# EAGLE design source_eagle (EAGLE 9.6.2)
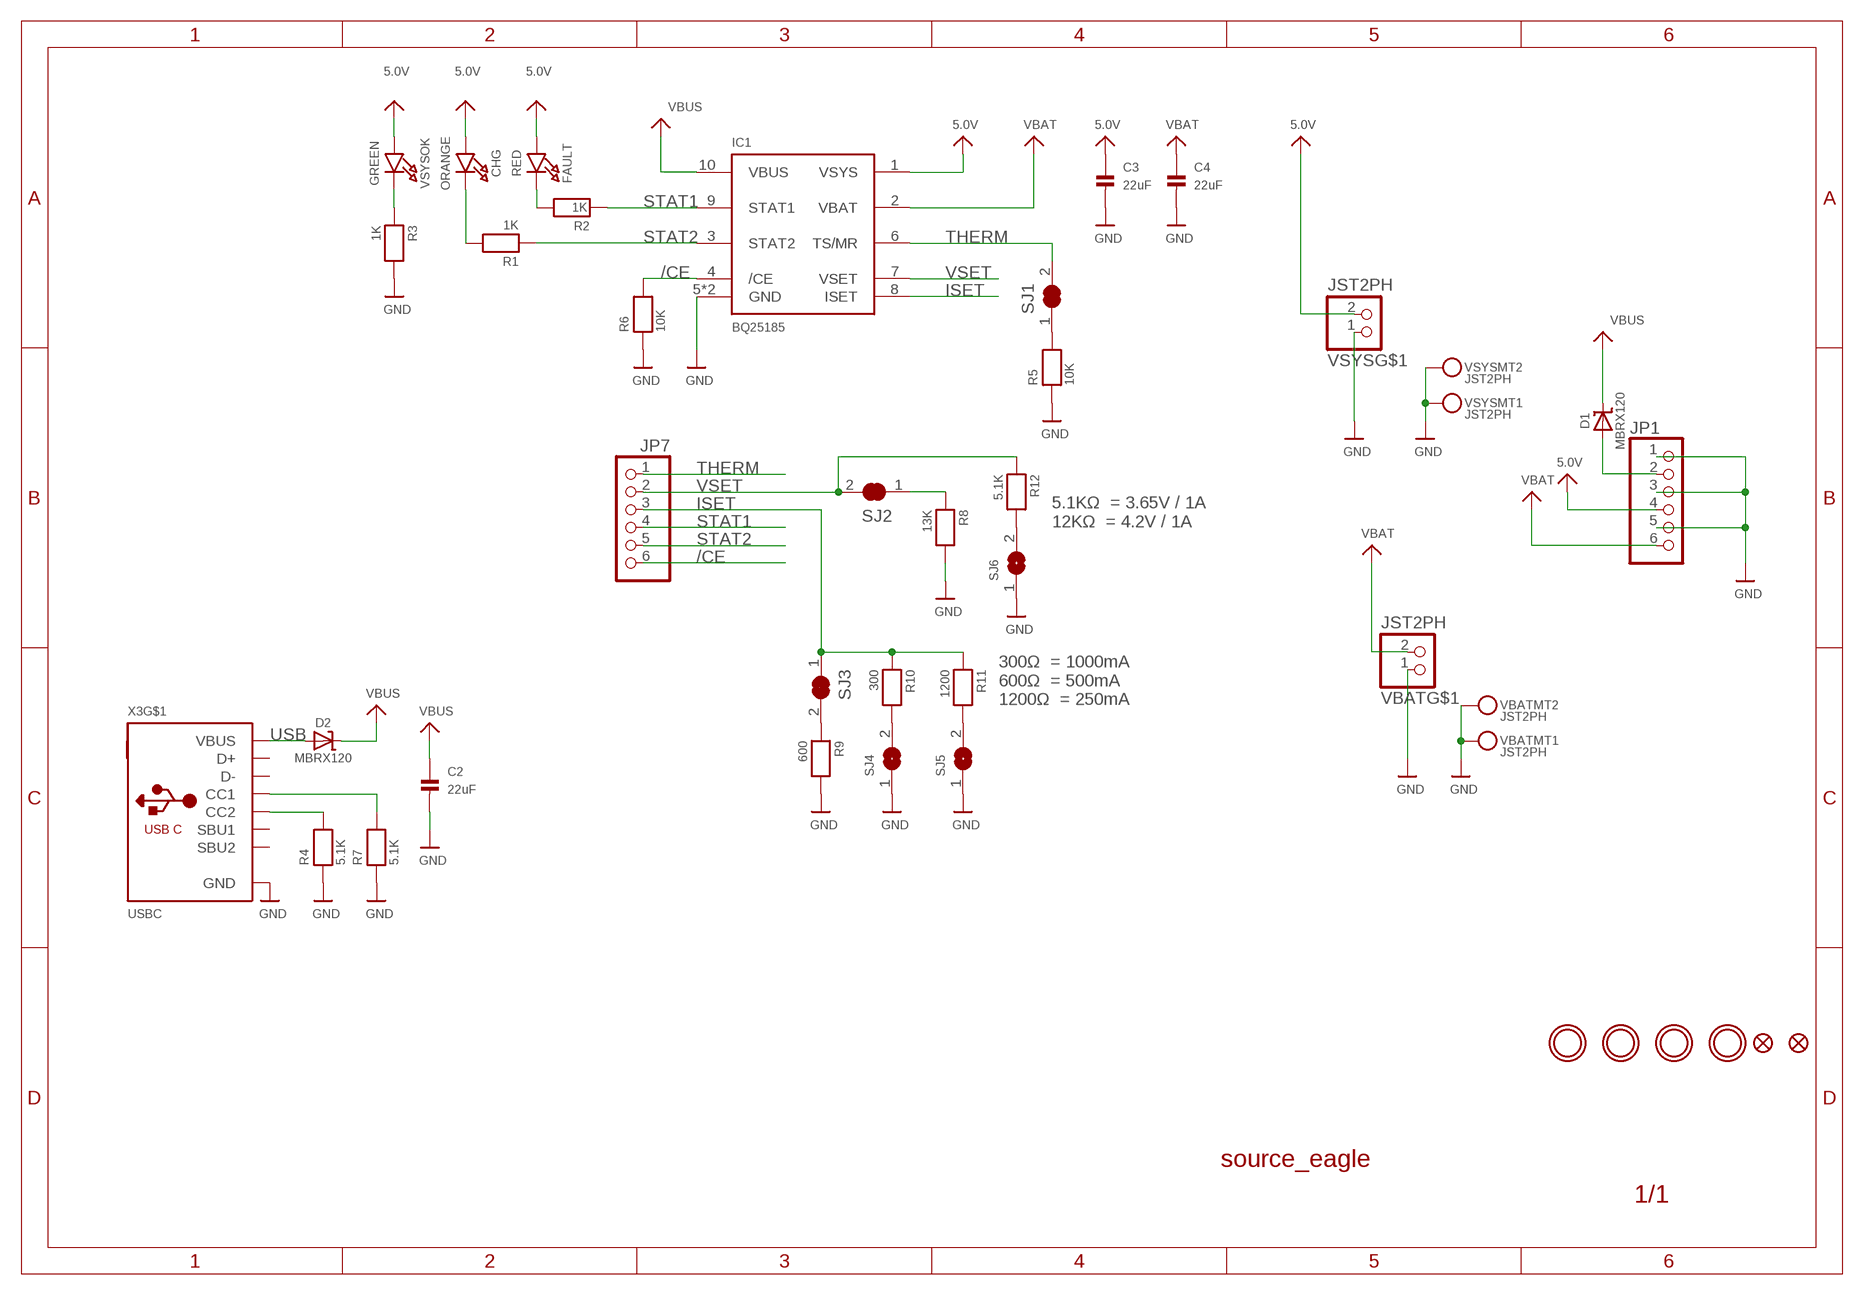
[diagram p0: schematic, sheet 1]

## Parts
C2  22uF  CAP_CERAMIC0805-NOOUTLINE  [0805-NO]
C3  22uF  CAP_CERAMIC0805-NOOUTLINE  [0805-NO]
C4  22uF  CAP_CERAMIC0805-NOOUTLINE  [0805-NO]
CHG  ORANGE  LED0805_NOOUTLINE  [CHIPLED_0805_NOOUTLINE]
D1  MBRX120  DIODE-SCHOTTKYSOD-123FL  [SOD-123FL]
D2  MBRX120  DIODE-SCHOTTKYSOD-123FL  [SOD-123FL]
FAULT  RED  LED0805_NOOUTLINE  [CHIPLED_0805_NOOUTLINE]
IC1  BQ25185  [WSON10]
JP1  HEADER-1X6OVALWAVE  [1X06_OVALWAVE]
JP2  FIDUCIAL1.5X3  FIDUCIAL_0.5MM  [FIDUCIAL_0.5MM]
JP4  FIDUCIAL1.5X3  FIDUCIAL_0.5MM  [FIDUCIAL_0.5MM]
JP7  HEADER-1X676MIL  [1X06_ROUND_76]
R1  1K  RESISTOR_0603_NOOUT  [0603-NO]
R2  1K  RESISTOR_0603_NOOUT  [0603-NO]
R3  1K  RESISTOR_0603_NOOUT  [0603-NO]
R4  5.1K  RESISTOR_0603_NOOUT  [0603-NO]
R5  10K  RESISTOR_0603_NOOUT  [0603-NO]
R6  10K  RESISTOR_0603_NOOUT  [0603-NO]
R7  5.1K  RESISTOR_0603_NOOUT  [0603-NO]
R8  13K  RESISTOR_0603_NOOUT  [0603-NO]
R9  600  RESISTOR_0603_NOOUT  [0603-NO]
R10  300  RESISTOR_0603_NOOUT  [0603-NO]
R11  1200  RESISTOR_0603_NOOUT  [0603-NO]
R12  5.1K  RESISTOR_0603_NOOUT  [0603-NO]
SJ1  SOLDERJUMPER_CLOSED  [SOLDERJUMPER_CLOSEDWIRE]
SJ2  SOLDERJUMPER_CLOSED  [SOLDERJUMPER_CLOSEDWIRE]
SJ3  SOLDERJUMPER_CLOSED  [SOLDERJUMPER_CLOSEDWIRE]
SJ4  SOLDERJUMPER  [SOLDERJUMPER_ARROW_NOPASTE]
SJ5  SOLDERJUMPER  [SOLDERJUMPER_ARROW_NOPASTE]
SJ6  SOLDERJUMPER  [SOLDERJUMPER_ARROW_NOPASTE]
U$11  MOUNTINGHOLE2.5  [MOUNTINGHOLE_2.5_PLATED]
U$16  MOUNTINGHOLE2.5  [MOUNTINGHOLE_2.5_PLATED]
U$18  MOUNTINGHOLE2.5  [MOUNTINGHOLE_2.5_PLATED]
U$19  MOUNTINGHOLE2.5  [MOUNTINGHOLE_2.5_PLATED]
VBAT  JST2PH  CON_JST_PH_2PIN_MT_BATT  [JSTPH2_BATT]
VSYS  JST2PH  CON_JST_PH_2PIN_MT_BATT  [JSTPH2_BATT]
VSYSOK  GREEN  LED0805_NOOUTLINE  [CHIPLED_0805_NOOUTLINE]
X3  USBC  USB_C  [USB_C_CUSB31-CFM2AX-01-X]

## Nets
5.0V: C3.1 CHG.A FAULT.A IC1.1(VSYS) JP1.4 VSYS.2 VSYSOK.A
/CE: IC1.4(/CE) JP7.6 R6.2
GND: C2.2 C3.2 C4.2 IC1.5(GND) IC1.PAD(GND) JP1.1 JP1.3 JP1.5 R3.2 R4.1 R5.1 R6.1 R7.1 R8.2 R9.2 SJ4.1 SJ5.1 SJ6.1 VBAT.1 VBAT.NC1 VBAT.NC2 VSYS.1 VSYS.NC1 VSYS.NC2 X3.A1B12(GND) X3.B1A12(GND)
ISET: IC1.8(ISET) JP7.3 R10.1 R11.1 SJ3.1
N$1: CHG.C R1.2
N$2: FAULT.C R2.2
N$3: R8.1 SJ2.1
N$4: R4.2 X3.B5(CC2)
N$5: R5.2 SJ1.1
N$6: R7.2 X3.A5(CC1)
N$7: R9.1 SJ3.2
N$8: R10.2 SJ4.2
N$9: R11.2 SJ5.2
N$10: R12.2 SJ6.2
N$11: D1.A JP1.2
N$12: R3.1 VSYSOK.C
STAT1: IC1.9(STAT1) JP7.4 R2.1
STAT2: IC1.3(STAT2) JP7.5 R1.1
THERM: IC1.6(TS/MR) JP7.1 SJ1.2
USB: D2.A X3.A4B9(VBUS) X3.B4A9(VBUS)
VBAT: C4.1 IC1.2(VBAT) JP1.6 VBAT.2
VBUS: C2.1 D1.C D2.C IC1.10(VBUS)
VSET: IC1.7(VSET) JP7.2 R12.1 SJ2.2
Unconnected: X3.A6(D+) X3.A7(D-) X3.A8(SBU1) X3.B6(D+) X3.B7(D-) X3.B8(SBU2) X3.M1(MT) X3.M2(MT) X3.M3(MT) X3.M4(MT)

## Notes on the sheet
- 5.1KΩ  = 3.65V / 1A
  12KΩ  = 4.2V / 1A
- 300Ω  = 1000mA
  600Ω  = 500mA
  1200Ω  = 250mA

## Library data of the parts
C2-C4 = microbuilder:CAP_CERAMIC: Ceramic Capacitors For new designs, use the packages preceded by an '_' character since they are more reliable: The following footprints should be used on most boards: _0402 - Standard footprint for regular board layouts _0603 - Standard footprint for regular board layouts _0805 - Standard footprint for regular board layouts _1206 - Standard footprint for regular board layouts For extremely tight-pitch boards where space is at a premium, the following 'micro-pitch' footprints can be used (smaller pads, no silkscreen outline, etc.): _0402MP - Micro-pitch footprint for very dense/compact boards _0603MP - Micro-pitch footprint for very dense/compact boards _0805MP - Micro-pitch footprint for very dense/compact boards _1206MP - Micro-pitch footprint for very dense/compact boards
CHG FAULT VSYSOK = microbuilder:LED: LED 0603 - 0603 Surface Mount Package 2mA: Green LED - Low Power (3.9mcd, 2ma, 1.7Vf) - Digikey: 475-2709-2-ND Orange LED - Low Power (9.8mcd, 2ma, 1.8Vf) - Digikey: 475-1194-2-ND Red LED - Low Power (5mcd, 2ma, 1.8Vf) - Digikey: 475-1195-2-ND Yellow LED - Low Power (7mcd, 2ma, 1.8Vf) - Digikey: 475-1196-2-ND 5mA: Blue LED - Low Power (17mcd, 5ma, 2.9Vf) - Digikey: LNJ937W8CRACT-ND 0805 - 0805 Surface Mount Package 2mA: Red LED (8.8mcd, 2mA, 1.8Vf, Clear) - Low Power [Digikey: 475-2510-1-ND] Green LED (5mcd, 2mA, 1.8Vf, Clear) - Low Power [Digikey: 475-2730-1-ND] Yellow LED (11.3mcd, 2mA, 1.8Vf, Clear) - Low Power [Digikey: 475-2555-1-ND] 20mA: Red LED (104mcd, 20mA, Diffused) - LS R976 [Digikey: 475-1278-6-ND] Red LED (12mcd, 20mA, 2.0Vf, Clear) - APT2012EC [Digikey: 754-1128-1-ND] Green LED (15mcd, 20mA, 2.2Vf, Clear) - APT2012GC [Digikey: 754-1131-1-ND] Orange LED (160mcd, 20mA, 2.1Vf, Clear) - APT2012SECK [Digikey: 754-1130-1-ND] 1206 - 1206 Surface Mount Package Green LED (26mcd, 20mA, Diffused) - LG N971 [Digikey: 475-1407-6-ND] Red LED (15mcd, 20mA, Diffused) - LH N974 [Digikey: 475-1416-6-ND] Cree - Cree High-Power Surface Mount LEDs XPEBWT-L1-0000-00D50 - White 111lm 350mA 2.9Vf 6200K 110° XTEAWT-00-0000-00000LEE3 - White 114lm 350mA 2.85Vf 5000K 115° Everlight - Everlight 45-21 Series Surface Mount LEDs 45-21/QK2C-B2832AC2CB2/2T - Warm White 2000mcd 20mA 3.25Vf 3050K 120° 45-21/LK2C-B38452C4CB2/2T - Nuetral White 2000mcd 20mA 3.25Vf 4150K 120° 45-21/LK2C-B50634C6CB2/2T - Cold White 2200mcd 20mA 3.25Vf 5650K 120° PLCC2 Reverse Mount LS T77K-J1L2-1-0-2-R18-Z - Red 11.25mcd 2mA 1.8Vf 630nm 120° LO T77K-L1M2-24-Z - Orange 19.6mcd 2mA 1.8Vf 606nm 120° LY T77K-K2M1-26-Z - Yellow 15.7mcd 2mA 1.8Vf 587nm 120°; ROT: 270
D1 D2 = microbuilder:DIODE-SCHOTTKY
IC1 = microbuilder:BQ25185
JP1 JP7 = microbuilder:HEADER-1X6: PIN HEADER
JP2 JP4 = microbuilder:FIDUCIAL: Fiducial Alignment Points Various fiducial points for machine vision alignment.
R1-R12 = microbuilder:RESISTOR: Resistors For new designs, use the packages preceded by an '_' character since they are more reliable: The following footprints should be used on most boards: _0402 - Standard footprint for regular board layouts _0603 - Standard footprint for regular board layouts _0805 - Standard footprint for regular board layouts _1206 - Standard footprint for regular board layouts For extremely tight-pitch boards where space is at a premium, the following 'micro-pitch' footprints can be used (smaller pads, no silkscreen outline, etc.): _0402MP - Micro-pitch footprint for very dense/compact boards _0603MP - Micro-pitch footprint for very dense/compact boards _0805MP - Micro-pitch footprint for very dense/compact boards _1206MP - Micro-pitch footprint for very dense/compact boards
SJ1-SJ3 = microbuilder:SOLDERJUMPER_CLOSED: Solder Jumper - Closed These solder jumpers are closed by default CLOSEDWIRE - 10 mil trace between pads that can be cut and resoldered later CLOSEDPERM - 63 mil trace between pads for a permanent connection (used to 'bridge' two signals, a shameless hack for Eagle). Can double as a test point as well (no cream layer)
SJ4-SJ6 = microbuilder:SOLDERJUMPER: SMD Solder JUMPER Solder the two pads together to create a connection, or remove the solder to break it. REFLOW - Use this footprint for solder paste and reflow ovens. WAVE - Use this footprint for hand-soldering (larger pads). CLOSED - Has a trace between the two pads to ensure it is closed by default. The trace needs to be cut to disable the jumper, and can be closed again by creating a solder bridge between the two pads.; BOM: EXCLUDE
U$11 U$16 U$18 U$19 = adafruit_electromech:MOUNTINGHOLE: Mounting Hole For #2 screws (0.086"/2.18mm width, 0.094"/2.4mm hole) use 2.5mm; BOM: EXCLUDE
VBAT VSYS = adafruit_electromech:CON_JST_PH_2PIN_MT; LCSC: C47647
X3 = adafruit_electromech:USB_C: USB Type-C USB 2.0 Connector; LCSC: C165948

## Board
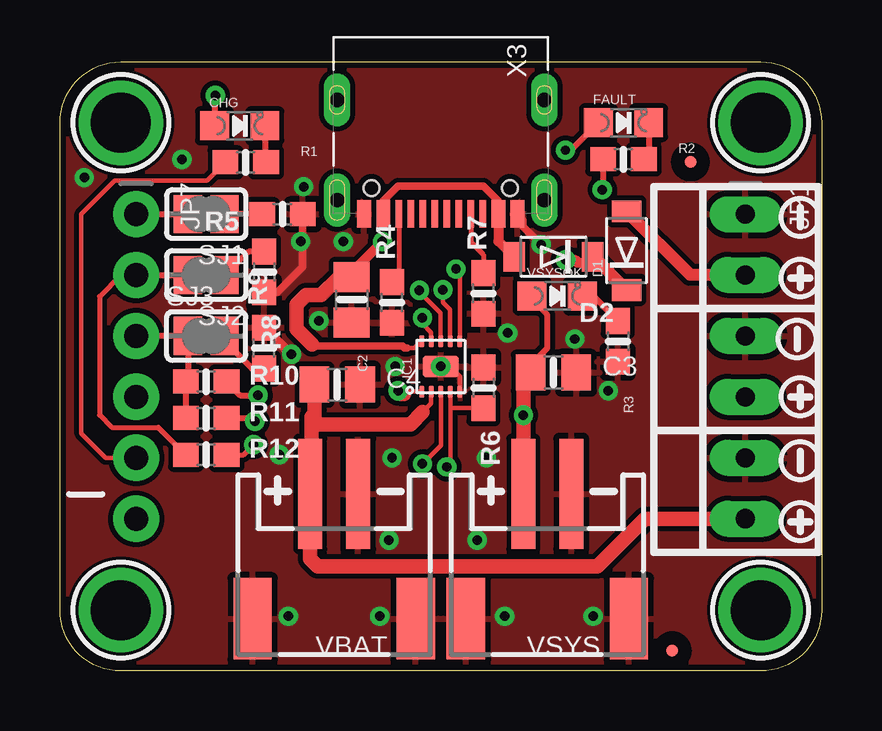
[diagram p1: board, top side]
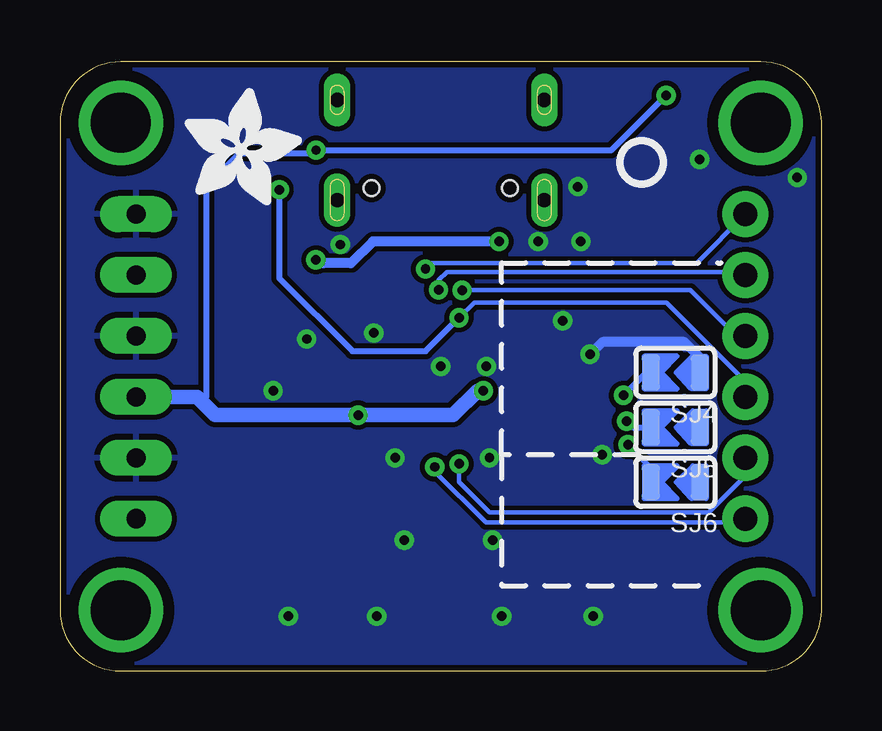
[diagram p2: board, bottom side, seen from below]

Size 31.75 x 25.4 mm. Coordinates in mm from the lower left corner, seen from the top.
Outline: 31.75,22.86 31.75,2.54 arc-90 29.21,0 2.54,0 arc-90 0,2.54 0,22.86 arc-90 2.54,25.4 29.21,25.4 arc-90 31.75,22.86
Copper layers (1*16): Top 0.035mm / dielectric 1.5mm / Bottom 0.035mm
Design rules "adafruit 7-7": minimum track width 7mil, minimum drill 15.5mil, track to track 8mil, track to pad 7mil, pad to pad 7mil, via to via 7mil, smd to smd 7mil, copper to edge 10mil, drill to drill 8mil, minimum pad ring 10mil, minimum via ring 8mil, stop-mask expansion 2mil, vias tented up to drill 20mil, thermal gap 10mil

### Footprints (pad centres in the part's own frame; a part is rotated, then mirrored left to right if it is on the bottom)
0805-NO = smd 1.24 x 1.5: 1 -0.95,0; 2 0.95,0
CHIPLED_0805_NOOUTLINE = smd 1.2 x 1.2: A 0,-1.05; C 0,1.05
SOD-123FL = smd 0.91 x 1.22: A 1.637,0; C -1.637,0
WSON10 = smd 0.5 x 0.2: 1 -1.05,0.8; 2 -1.05,0.4; 3 -1.05,0; 4 -1.05,-0.4; 5 -1.05,-0.8; 6 1.05,-0.8; 7 1.05,-0.4; 8 1.05,0; 9 1.05,0.4; 10 1.05,0.8 | smd 0.9 x 1.5: PAD 0,0
1X06_OVALWAVE = drill 0.8 pad 1.5 long: 1 -6.35,0; 2 -3.81,0; 3 -1.27,0; 4 1.27,0; 5 3.81,0; 6 6.35,0
FIDUCIAL_0.5MM = smd 0.5 x 0.5: 1 0,0
1X06_ROUND_76 = drill 1 pad 1.93: 1 -6.35,0; 2 -3.81,0; 3 -1.27,0; 4 1.27,0; 5 3.81,0; 6 6.35,0
0603-NO = smd 1.075 x 1: 1 -0.85,0; 2 0.85,0
SOLDERJUMPER_CLOSEDWIRE = smd 1.168 x 1.6: 1 -0.762,0; 2 0.762,0 | smd 0.635 x 0.203: WIRE 0,0
SOLDERJUMPER_ARROW_NOPASTE = smd 0.762 x 1.524: 1 -1.016,0; 2 1.016,0
MOUNTINGHOLE_2.5_PLATED = drill 2.5 pad 3.2: P$1 0,0
JSTPH2_BATT = smd 1 x 4.6: 1 -1,-2.303; 2 1,-2.303 | smd 1.6 x 3.4: NC1 -3.4,2.897; NC2 3.4,2.897
USB_C_CUSB31-CFM2AX-01-X = smd 0.575 x 1.15: A1B12 -3.2,2.275; A4B9 -2.4,2.275; B1A12 3.2,2.275; B4A9 2.4,2.275 | smd 0.275 x 1.15: A5 -1.25,2.275; A6 -0.25,2.275; A7 0.25,2.275; A8 1.25,2.275; B5 1.75,2.275; B6 0.75,2.275; B7 -0.75,2.275; B8 -1.75,2.275 | drill 0.6 pad 1 long: M1 -4.32,1.7; M2 4.32,1.7; M3 -4.32,-2.48; M4 4.32,-2.48 | hole 0.65: 2.89,1.2; -2.89,1.2

### Placement (x,y rotation side)
C2  12.16,15.48 270 top
C3  20.57,12.45 0 top
C4  11.56,11.94 0 top
CHG  7.49,22.73 270 top
D1  23.62,17.53 90 top
D2  20.57,17.27 180 top
FAULT  23.5,22.86 270 top
IC1  15.88,12.7 90 top
JP1  28.57,12.7 270 top
JP2  25.53,0.85 0 top
JP4  26.29,21.22 0 top
JP7  3.17,12.7 270 top
PLABEL0  [PLABEL0]  18.54,9.91 0 top
PLABEL1  [PLABEL1]  9.14,9.78 0 top
PLABEL2  [PLABEL2]  18.88,13.42 0 top
PLABEL3  [PLABEL3]  21.08,23.75 0 top
PLABEL4  [PLABEL4]  4.7,23.75 0 top
PLABEL5  [PLABEL5]  0.25,19.05 0 top
PLABEL6  [PLABEL6]  25.91,7.62 90 top
PLABEL7  [PLABEL7]  25.91,12.7 90 top
PLABEL8  [PLABEL8]  25.91,17.53 90 top
PLABEL9  [PLABEL9]  0.25,16.51 0 top
PLABEL10  [PLABEL10]  0.51,13.97 0 top
PLABEL11  [PLABEL11]  0.38,11.43 0 top
PLABEL12  [PLABEL12]  0.38,8.89 0 top
PLABEL13  [PLABEL13]  -0.25,6.48 0 top
PLABEL14  [PLABEL14]  6.6,0.38 90 top
PLABEL15  [PLABEL15]  8,7.87 0 bottom
PLABEL16  [PLABEL16]  8.13,10.16 0 bottom
PLABEL17  [PLABEL17]  8,12.45 0 bottom
PLABEL18  [PLABEL18]  12.83,5.33 0 bottom
PLABEL19  [PLABEL19]  13.08,15.11 0 bottom
PLABEL20  [PLABEL20]  15.75,21.72 0 bottom
PLABEL21  [PLABEL21]  20.32,12.95 0 bottom
PLABEL22  [PLABEL22]  19.81,3.43 0 bottom
R1  7.75,21.21 0 top
R2  23.5,21.34 0 top
R3  23.26,13.75 270 top
R4  13.84,15.37 90 top
R5  9.27,19.05 180 top
R6  17.65,11.81 270 top
R7  17.65,15.75 90 top
R8  8.51,16.64 270 top
R9  8.51,13.46 90 top
R10  6.1,12.06 0 top
R11  6.1,10.54 0 top
R12  6.1,9.02 0 top
SJ1  6.1,19.05 180 top
SJ2  6.1,16.51 180 top
SJ3  6.1,13.97 0 top
SJ4  6.1,12.45 180 bottom
SJ5  6.1,10.16 180 bottom
SJ6  6.1,7.87 180 bottom
U$11  29.21,2.54 0 top
U$16  29.21,22.86 0 top
U$18  2.54,22.86 0 top
U$19  2.54,2.54 0 top
U$23  [SYMBOL_PLUS]  30.86,11.43 0 top
U$24  [SYMBOL_MINUS]  30.73,13.84 90 top
U$25  [SYMBOL_MINUS]  30.86,18.92 90 top
U$26  [SYMBOL_MINUS]  30.86,8.76 90 top
U$27  [SYMBOL_PLUS]  30.86,16.38 0 top
U$28  [SYMBOL_PLUS]  30.86,6.22 0 top
U$46  [ADAFRUIT_5MM]  26.54,19.43 0 bottom
U$47  [PCBFEAT-REV-040]  7.49,21.21 0 bottom
VBAT  11.43,5.08 180 top
VSYS  20.32,5.08 180 top
VSYSOK  20.73,15.64 270 top
X3  15.88,21.34 180 top

### Tracks (layer width: path | path; a pad name or v marks a point on that pad's centre or on a via)
5.0V  (via drill 0.39)
  Top 0.178: IC1.1 14.26,11.65 14.35,11.56
  Top 0.254: C3.1 19.62,12.77 20.32,13.46 20.32,14.86 19.68,15.5 VSYSOK.A | FAULT.A 21.3,21.72 v21.07,21.72 | v6.48,24 6.44,23.97 CHG.A
  Top 0.61: VSYS.2 v19.32,10.67 19.32,12.14 C3.1 | 14.35,11.56 14.22,11.56 v14.1,11.68
  Bottom 0.254: v6.48,24 8.76,21.72 v21.07,21.72 21.2,21.59 24.26,21.59 25.65,20.19 25.65,11.43 26.04,11.43
  Bottom 0.61: v14.1,11.68 14.35,11.68 15.37,10.67 v19.32,10.67 25.27,10.67 26.04,11.43 JP1.4
/CE  (via drill 0.39)
  Top 0.178: IC1.4 16.27,10.96 | 16.27,10.96 R6.2 | v16.13,8.51 16.27,8.65 16.27,10.96
  Bottom 0.178: v16.13,8.51 16.13,8.33 13.99,6.19 3.33,6.19 JP7.6
GND  (via drill 0.39)
  Top 0.178: IC1.5 16.68,12.28 16.26,12.7 IC1.PAD
  Top 0.305: R8.2 9.06,15.79 10.12,16.85 R5.1 | 19.05,19.06 19.31,18.8 19.31,18.54 v20.07,17.78
  Top 0.406: R9.2 9.61,13.21 v9.65,13.21
  Top 0.61: X3.A1B12 19.05,19.06
  Bottom 0.406: SJ4.1 5.08,13.08 5.71,13.72 9.14,13.72 v9.65,13.21
  other vias: 13.97,12.7 13.84,8.89 17.78,8.89 22.86,11.68 13.72,5.46 17.4,5.46 9.53,2.29 13.34,2.29 18.54,2.29 22.23,2.29 10.79,14.61 10.16,20.19 5.08,21.34 1.02,20.57 18.67,14.1 21.46,13.84 11.81,17.91 10.03,17.91 15.88,12.7 9.14,9.02
  pour Bottom (isolate 0.203): 0,25.4 31.75,25.4 31.75,0.13 0,0
  pour Top (isolate 0.203): 0,25.4 31.75,25.4 31.75,0.13 0,0
ISET  (via drill 0.39)
  Top 0.178: IC1.8 15.86,13.77 15.86,14.93 14.99,15.8 v14.99,15.88
  Top 0.254: JP7.3 SJ3.1 5.33,12.15 R10.1 R11.1
  Bottom 0.178: v14.99,15.88 5.46,15.88 3.56,13.97 JP7.3
N$1
  Top 0.254: CHG.C 8.54,21.26 R1.2
N$2
  Top 0.254: FAULT.C 24.55,21.54 R2.2
N$3
  Top 0.254: R8.1 7.87,17.49 6.9,16.51 SJ2.1
N$4
  Top 0.203: X3.B5 14.12,16.5 R4.2
N$5
  Top 0.254: R5.2 SJ1.1
N$6
  Top 0.203: X3.A5 17.12,17.89 17.65,17.36 R7.2
N$7
  Top 0.254: SJ3.2 7.24,13.59 7.24,13.37 8,12.61 R9.1
N$8  (via drill 0.39)
  Top 0.254: R10.2 7.51,11.5 v8.26,11.5
  Bottom 0.254: v8.26,11.5 7.31,12.45 SJ4.2
N$9  (via drill 0.39)
  Top 0.254: R11.2 8,10.54 v8.13,10.41
  Bottom 0.254: v8.13,10.41 7.87,10.16 SJ5.2
N$10  (via drill 0.39)
  Top 0.203: R12.2 7.65,9.02 v8.07,9.44
  Bottom 0.203: v8.07,9.44 7.11,8.48 SJ6.2
N$11
  Top 0.508: JP1.2 26.28,16.51 D1.A
N$12
  Top 0.254: VSYSOK.C 22,15.85 R3.1
STAT1  (via drill 0.39)
  Top 0.178: IC1.9 15.47,14.12 15.11,14.48 v15.11,14.73
  Top 0.254: R2.1 22.64,20.11 v22.61,20.07
  Bottom 0.178: v15.11,14.73 14.48,15.37 6.48,15.37 3.17,12.06 JP7.4
  Bottom 0.254: v22.61,20.07 22.61,16.38 19.56,13.34 16.51,13.34 v15.11,14.73
STAT2  (via drill 0.39)
  Top 0.178: IC1.3 15.88,9.4 v15.11,8.64 | JP7.5 1.91,8.89 0.89,9.91 0.89,19.05 2.29,20.45 6.13,20.45 R1.1
  Bottom 0.178: v15.11,8.64 15.11,7.87 13.84,6.6 4.7,6.6 3.17,8.13 JP7.5
THERM  (via drill 0.39)
  Top 0.178: IC1.6 16.68,16.6 v16.51,16.76
  Top 0.254: JP7.1 SJ1.2
  Bottom 0.178: v16.51,16.76 16.26,17.02 5.21,17.02 JP7.1
USB
  Top 0.305: X3.B4A9 13.47,19.59 14.1,20.21 17.65,20.21 18.27,19.59 X3.A4B9
  Top 0.406: X3.A4B9 18.27,17.92 18.92,17.27 D2.A
VBAT
  Top 0.178: IC1.2 15.47,11.16 15.11,10.79
  Top 0.61: 15.11,10.79 14.61,10.29 10.79,10.29 10.61,10.47 | 10.61,10.47 10.48,10.6 10.48,7.43 VBAT.2 10.43,4.68 10.75,4.37 22.4,4.37 24.38,6.35 JP1.6 | 10.61,10.47 C4.1
VBUS  (via drill 0.39)
  Top 0.178: IC1.10 14.79,13.46 14.48,13.46
  Top 0.305: 14.48,13.46 14.37,13.46 14.27,13.56 10.57,13.56 10.51,13.62
  Top 0.406: 12.15,16.41 C2.1 12.16,16.62 v13.45,17.91 | v21.08,17.14 21.46,17.14 21.59,17.02 21.96,17.02 D2.C
  Top 0.508: D2.C 22.24,17.27 D1.C
  Top 0.61: C2.1 11.65,16.43 10.89,15.67 10.26,15.67 9.87,15.29 9.87,14.26 10.51,13.62
  Bottom 0.406: v13.45,17.91 18.71,17.91 19.61,17 20.77,17 20.92,17.14 v21.08,17.14
VSET  (via drill 0.39)
  Top 0.178: IC1.7 16.26,13.77 16.26,15.07 15.96,15.36 v15.96,15.89
  Top 0.203: JP7.2 2.54,16.51 1.65,15.62 1.65,10.67 2.16,10.16 4.1,10.16 R12.1
  Top 0.254: JP7.2 SJ2.2
  Bottom 0.178: v15.96,15.89 15.96,16.29 15.62,16.64 3.94,16.64 3.81,16.51 JP7.2

### Text on the board
Pinguin_tBackup: CHRG | FAULT | TH | DCIN | VS | IS | PWR | LOAD | S1 | BATT | LOAD | S2 | BATT | !CE | BQ25185
Pinguin_bBackup: Cut ISet to / change curr | 250mA | 3.65V | Cut VSet to / change volts | USB / DC in / DCIN:5~18V / w/Solar Tracking